# EAGLE design RevA (EAGLE 9.1.3)
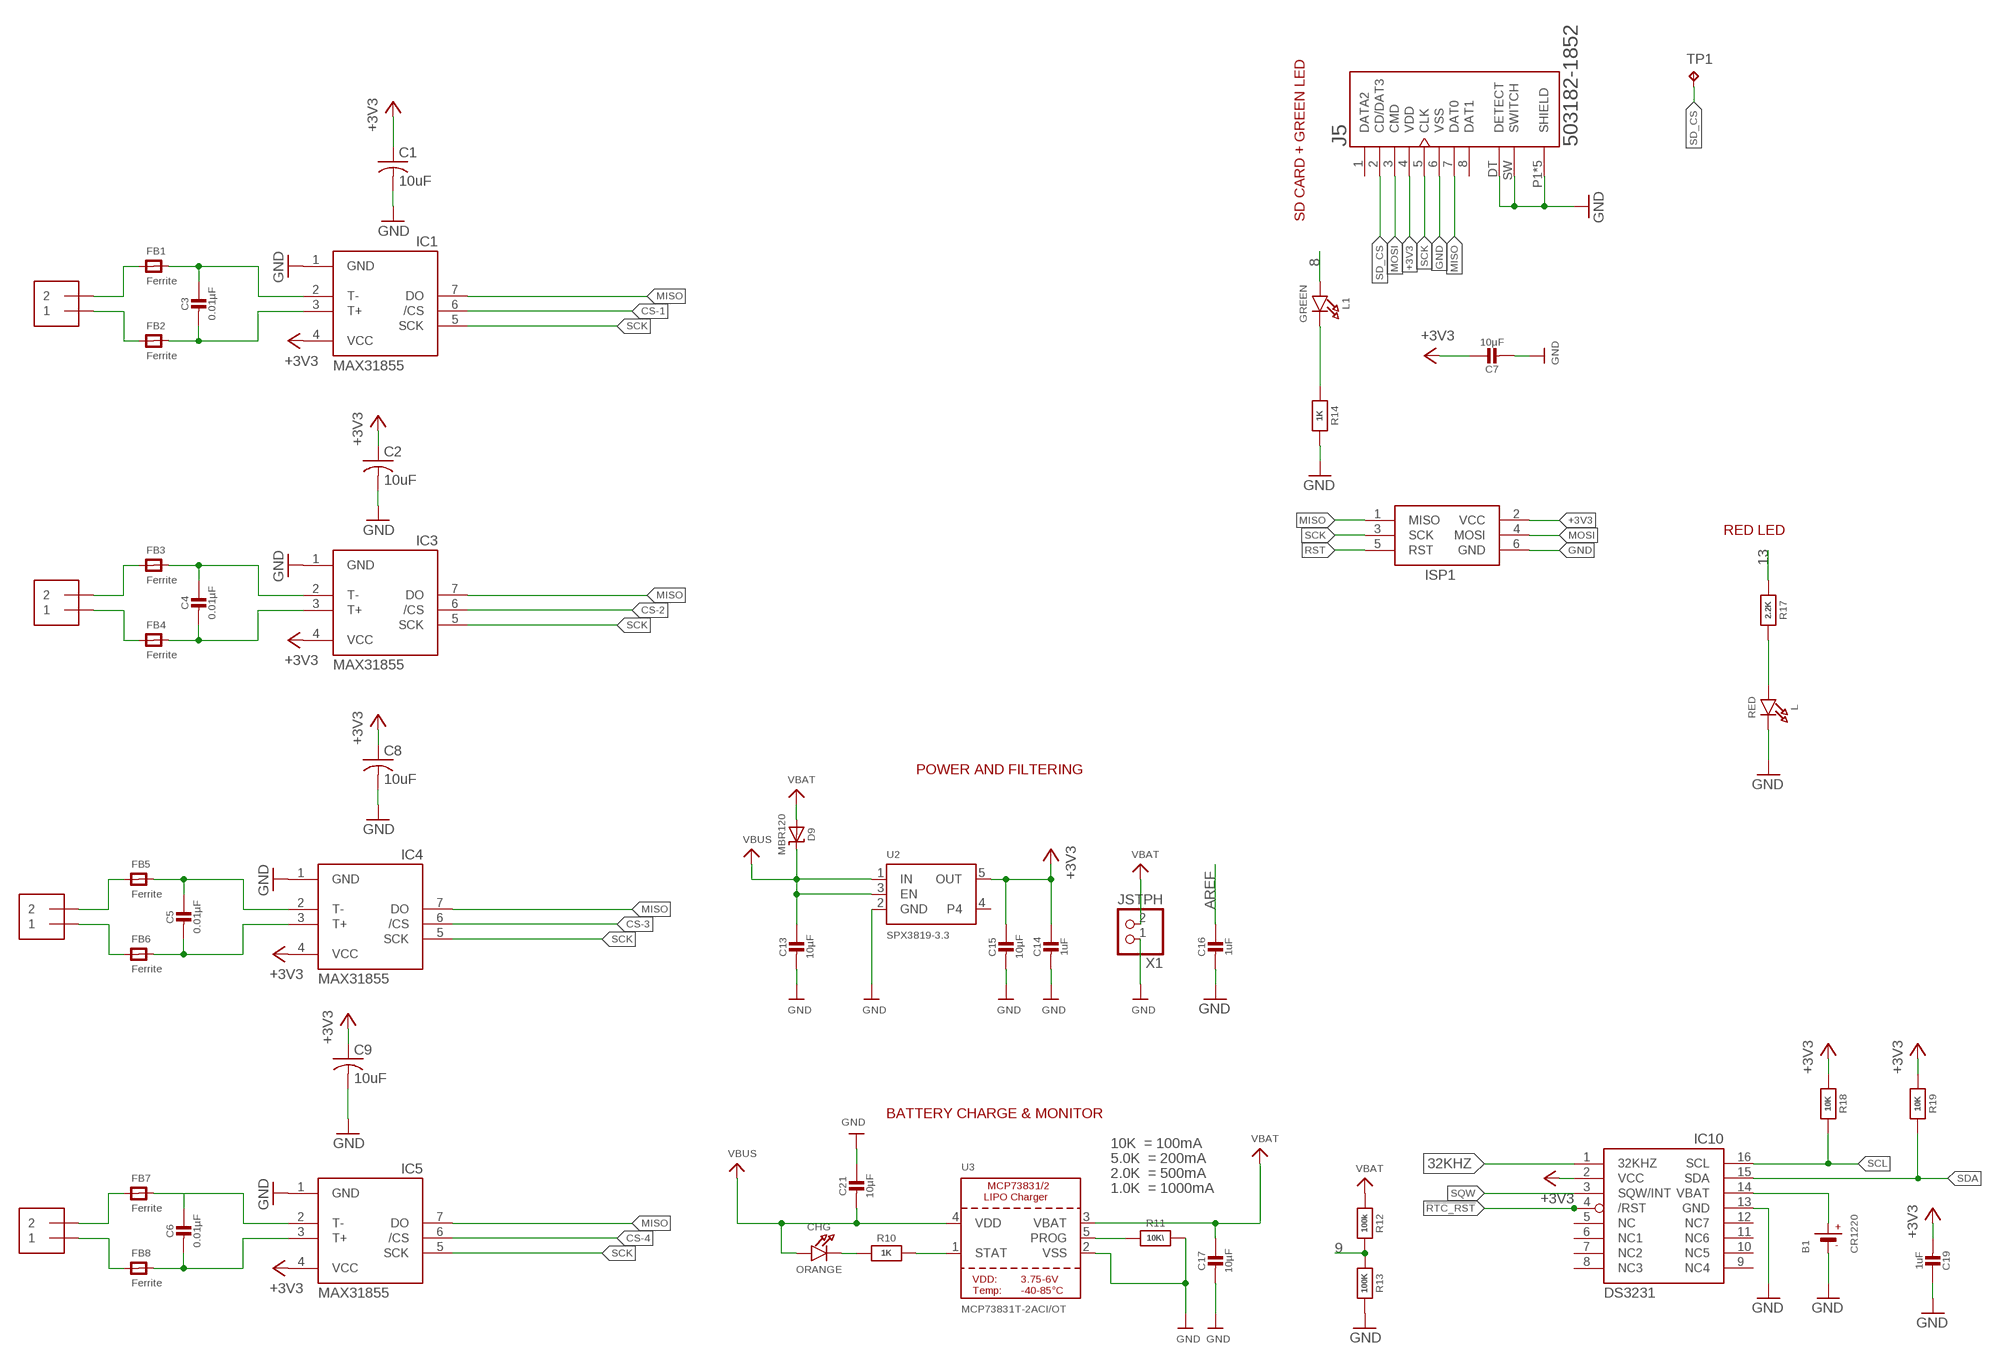
[diagram p0: schematic, sheet 1, part 1 of 2]
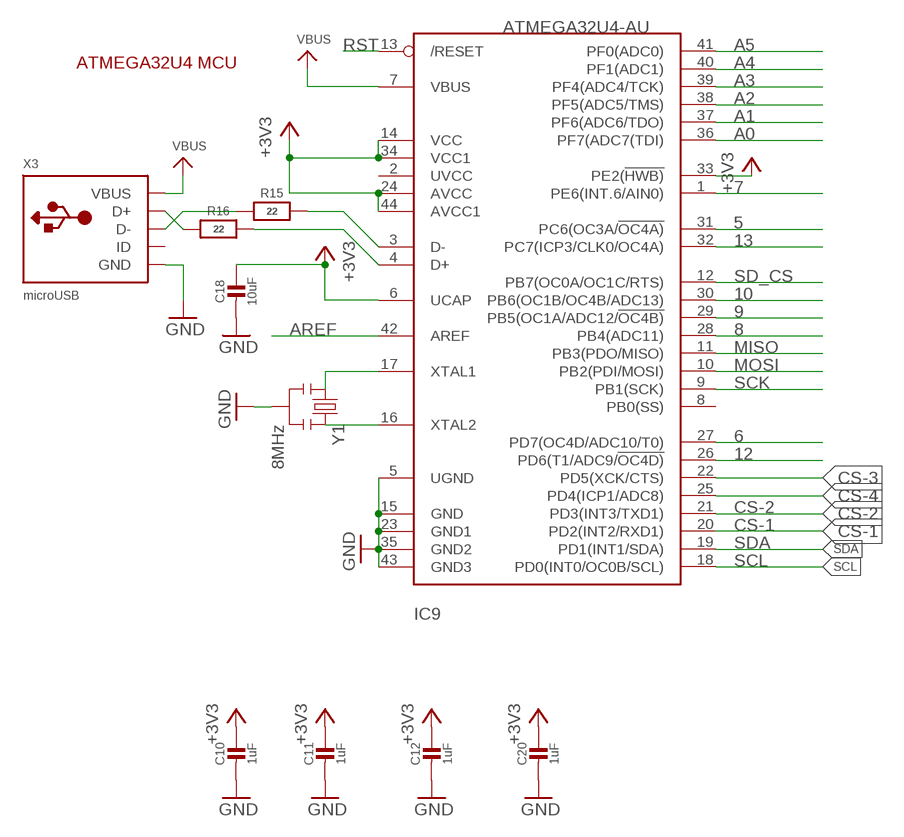
[diagram p1: schematic, sheet 1, part 2 of 2]

## Parts
B1  CR1220  BATTERYCR1220_SMT  [CR1220]
C1  10uF  C-USC0805K  [C0805K]
C2  10uF  C-USC0805K  [C0805K]
C3  0.01µF  CAP_CERAMIC_0805  [_0805]
C4  0.01µF  CAP_CERAMIC_0805  [_0805]
C5  0.01µF  CAP_CERAMIC_0805  [_0805]
C6  0.01µF  CAP_CERAMIC_0805  [_0805]
C7  10µF  CAP_CERAMIC0805-NOOUTLINE  [0805-NO]
C8  10uF  C-USC0805K  [C0805K]
C9  10uF  C-USC0805K  [C0805K]
C10  1uF  CAP_CERAMIC0603_NO  [0603-NO]
C11  1uF  CAP_CERAMIC0603_NO  [0603-NO]
C12  1uF  CAP_CERAMIC0603_NO  [0603-NO]
C13  10µF  CAP_CERAMIC0805-NOOUTLINE  [0805-NO]
C14  1uF  CAP_CERAMIC0603_NO  [0603-NO]
C15  10µF  CAP_CERAMIC0805-NOOUTLINE  [0805-NO]
C16  1uF  CAP_CERAMIC0603_NO  [0603-NO]
C17  10µF  CAP_CERAMIC0805-NOOUTLINE  [0805-NO]
C18  10uF  CAP_CERAMIC0805-NOOUTLINE  [0805-NO]
C19  1uF  CAP_CERAMIC0805-NOOUTLINE  [0805-NO]
C20  1uF  CAP_CERAMIC0603_NO  [0603-NO]
C21  10µF  CAP_CERAMIC0805-NOOUTLINE  [0805-NO]
CHG  ORANGE  LED0805_NOOUTLINE  [CHIPLED_0805_NOOUTLINE]
D9  MBR120  DIODE-SCHOTTKYSOD-123  [SOD-123]
FB1  Ferrite  FERRITE_0805  [_0805]
FB2  Ferrite  FERRITE_0805  [_0805]
FB3  Ferrite  FERRITE_0805  [_0805]
FB4  Ferrite  FERRITE_0805  [_0805]
FB5  Ferrite  FERRITE_0805  [_0805]
FB6  Ferrite  FERRITE_0805  [_0805]
FB7  Ferrite  FERRITE_0805  [_0805]
FB8  Ferrite  FERRITE_0805  [_0805]
IC1  MAX31855  MAX6675  [SO08]
IC3  MAX31855  MAX6675  [SO08]
IC4  MAX31855  MAX6675  [SO08]
IC5  MAX31855  MAX6675  [SO08]
IC9  ATMEGA32U4-AU  [TQFP44]
IC10  DS3231/SO  [SO16W]
ISP1  AVRISP-BOX  [AVRISP-BOX]
J1  1X2-3.5MM  [1X2-3.5MM]
J2  1X2-3.5MM  [1X2-3.5MM]
J3  1X2-3.5MM  [1X2-3.5MM]
J4  1X2-3.5MM  [1X2-3.5MM]
J5  503182-1852  [MOLEX_503182-1852]
L  RED  LED0805_NOOUTLINE  [CHIPLED_0805_NOOUTLINE]
L1  GREEN  LED0805_NOOUTLINE  [CHIPLED_0805_NOOUTLINE]
R10  1K  RESISTOR_0603_NOOUT  [0603-NO]
R11  10K\  RESISTOR_0603_NOOUT  [0603-NO]
R12  100k  RESISTOR_0603MP  [_0603MP]
R13  100K  RESISTOR_0603MP  [_0603MP]
R14  1K  RESISTOR_0603_NOOUT  [0603-NO]
R15  22  RESISTOR_0603_NOOUT  [0603-NO]
R16  22  RESISTOR_0603_NOOUT  [0603-NO]
R17  2.2K  RESISTOR_0603_NOOUT  [0603-NO]
R18  10K  RESISTOR0805_NOOUTLINE  [0805-NO]
R19  10K  RESISTOR0805_NOOUTLINE  [0805-NO]
TP1  TPPAD1-13  [P1-13]
U2  SPX3819-3.3  VREG_SOT23-5  [SOT23-5]
U3  MCP73831T-2ACI/OT  MCP73831/2  [SOT23-5]
X1  JSTPH  CON_JST_PH_2PIN  [JSTPH2]
X3  microUSB  USB_MICRO_20329_V2  [4UCONN_20329_V2]
Y1  8MHz  RESONATORSMD  [RESONATOR-SMD]

## Nets
5: IC9.31(PC6(OC3A/!OC4A))
6: IC9.27(PD7(OC4D/ADC10/T0))
7: IC9.1(PE6(INT.6/AIN0))
8: IC9.28(PB4(ADC11)) L1.A
9: IC9.29(PB5(OC1A/ADC12/!OC4B)) R12.2 R13.1
10: IC9.30(PB6(OC1B/OC4B/ADC13))
12: IC9.26(PD6(T1/ADC9/!OC4D))
13: IC9.32(PC7(ICP3/CLK0/OC4A)) R17.1
32KHZ: IC10.1(32KHZ)
!RTC_RST: IC10.4(/RST)
+3V3: C1.1 C2.1 C7.1 C8.1 C9.1 C10.1 C11.1 C12.1 C14.1 C15.1 C18.1 C19.2 C20.1 IC1.4(VCC) IC3.4(VCC) IC4.4(VCC) IC5.4(VCC) IC9.6(UCAP) IC9.14(VCC) IC9.24(AVCC) IC9.33(PE2(!HWB)) IC9.34(VCC1) IC9.44(AVCC1) IC10.2(VCC) ISP1.2(VCC) J5.4(VDD) R18.1 R19.1 U2.5(OUT)
A0: IC9.36(PF7(ADC7(TDI))
A1: IC9.37(PF6(ADC6/TDO))
A2: IC9.38(PF5(ADC5/TMS))
A3: IC9.39(PF4(ADC4/TCK))
A4: IC9.40(PF1(ADC1))
A5: IC9.41(PF0(ADC0))
AREF: C16.1 IC9.42(AREF)
CS-1: IC1.6(/CS) IC9.20(PD2(INT2/RXD1))
CS-2: IC3.6(/CS) IC9.21(PD3(INT3/TXD1))
CS-3: IC4.6(/CS) IC9.22(PD5(XCK/CTS))
CS-4: IC5.6(/CS) IC9.25(PD4(ICP1/ADC8))
D+: IC9.4(D+) R16.2
D-: IC9.3(D-) R15.2
GND: B1.- C1.2 C2.2 C7.2 C8.2 C9.2 C10.2 C11.2 C12.2 C13.2 C14.2 C15.2 C16.2 C17.2 C18.2 C19.1 C20.2 C21.1 IC1.1(GND) IC3.1(GND) IC4.1(GND) IC5.1(GND) IC9.5(UGND) IC9.15(GND) IC9.23(GND1) IC9.35(GND2) IC9.43(GND3) IC10.13(GND) ISP1.6(GND) J5.6(VSS) J5.DT(DETECT) J5.P1(SHIELD) J5.P2(SHIELD) J5.P3(SHIELD) J5.P4(SHIELD) J5.P5(SHIELD) J5.SW(SWITCH) L.C R11.2 R13.2 R14.2 U2.2(GND) U3.2(VSS) X1.1 X3.BASE@1(GND) X3.BASE@2(GND) X3.GND X3.SPRT@1(GND) X3.SPRT@2(GND) X3.SPRT@3(GND) X3.SPRT@4(GND) Y1.2
MISO: IC1.7(DO) IC3.7(DO) IC4.7(DO) IC5.7(DO) IC9.11(PB3(PDO/MISO)) ISP1.1(MISO) J5.7(DAT0)
MOSI: IC9.10(PB2(PDI/MOSI)) ISP1.4(MOSI) J5.3(CMD)
N$1: FB1.1 J1.2
N$2: FB3.1 J2.2
N$3: C4.1 FB3.2 IC3.2(T-)
N$4: C3.1 FB1.2 IC1.2(T-)
N$5: FB2.1 J1.1
N$6: C3.2 FB2.2 IC1.3(T+)
N$7: FB4.1 J2.1
N$8: C4.2 FB4.2 IC3.3(T+)
N$9: FB5.1 J3.2
N$10: C5.1 FB5.2 IC4.2(T-)
N$11: FB6.1 J3.1
N$12: C5.2 FB6.2 IC4.3(T+)
N$13: FB7.1 J4.2
N$14: C6.1 FB7.2 IC5.2(T-)
N$15: FB8.1 J4.1
N$16: C6.2 FB8.2 IC5.3(T+)
N$25: CHG.C R10.1
N$26: R10.2 U3.1(STAT)
N$27: R11.1 U3.5(PROG)
N$28: L1.C R14.1
N$29: IC9.16(XTAL2) Y1.3
N$30: IC9.17(XTAL1) Y1.1
N$31: R16.1 X3.D+
N$32: R15.1 X3.D-
N$33: L.A R17.2
RST: IC9.13(/RESET) ISP1.5(RST)
SCK: IC1.5(SCK) IC3.5(SCK) IC4.5(SCK) IC5.5(SCK) IC9.9(PB1(SCK)) ISP1.3(SCK) J5.5(CLK)
SCL: IC9.18(PD0(INT0/OC0B/SCL)) IC10.16(SCL) R18.2
SD_CS: IC9.12(PB7(OC0A/OC1C/RTS)) J5.2(CD/DAT3) TP1.TP
SDA: IC9.19(PD1(INT1/SDA)) IC10.15(SDA) R19.2
SQW: IC10.3(SQW/INT)
VBAT: C17.1 D9.A R12.1 U3.3(VBAT) X1.2
VBUS: C13.1 C21.2 CHG.A D9.C IC9.7(VBUS) U2.1(IN) U2.3(EN) U3.4(VDD) X3.VBUS
VCR: B1.+$1(+) IC10.14(VBAT)
Unconnected: IC9.2(UVCC) IC9.8(PB0(SS)) IC10.5(NC) IC10.6(NC1) IC10.7(NC2) IC10.8(NC3) IC10.9(NC4) IC10.10(NC5) IC10.11(NC6) IC10.12(NC7) J5.1(DATA2) J5.8(DAT1) U2.4 X3.ID

## Notes on the sheet
- ATMEGA32U4 MCU
- SD CARD + GREEN LED
- RED LED
- POWER AND FILTERING
- BATTERY CHARGE & MONITOR
- 10K  = 100mA
- 5.0K  = 200mA
- 2.0K  = 500mA
- 1.0K  = 1000mA

## Library data of the parts
B1 = microbuilder:BATTERY: CR1220 SMT - Digikey: 3001K-ND CD2032 BAT-HLD-001 - Digikey: BAT-HLD-001-ND
C1 C2 C8 C9 = adafruit:C-US: CAPACITOR, American symbol
C3-C7 C10-C21 = microbuilder:CAP_CERAMIC: Ceramic Capacitors For new designs, use the packages preceded by an '_' character since they are more reliable: The following footprints should be used on most boards: _0402 - Standard footprint for regular board layouts _0603 - Standard footprint for regular board layouts _0805 - Standard footprint for regular board layouts _1206 - Standard footprint for regular board layouts For extremely tight-pitch boards where space is at a premium, the following 'micro-pitch' footprints can be used (smaller pads, no silkscreen outline, etc.): _0402MP - Micro-pitch footprint for very dense/compact boards _0603MP - Micro-pitch footprint for very dense/compact boards _0805MP - Micro-pitch footprint for very dense/compact boards _1206MP - Micro-pitch footprint for very dense/compact boards
CHG L L1 = microbuilder:LED: LED 0603 - 0603 Surface Mount Package 2mA: Green LED - Low Power (3.9mcd, 2ma, 1.7Vf) - Digikey: 475-2709-2-ND Orange LED - Low Power (9.8mcd, 2ma, 1.8Vf) - Digikey: 475-1194-2-ND Red LED - Low Power (5mcd, 2ma, 1.8Vf) - Digikey: 475-1195-2-ND Yellow LED - Low Power (7mcd, 2ma, 1.8Vf) - Digikey: 475-1196-2-ND 5mA: Blue LED - Low Power (17mcd, 5ma, 2.9Vf) - Digikey: LNJ937W8CRACT-ND 0805 - 0805 Surface Mount Package 2mA: Red LED (8.8mcd, 2mA, 1.8Vf, Clear) - Low Power [Digikey: 475-2510-1-ND] Green LED (5mcd, 2mA, 1.8Vf, Clear) - Low Power [Digikey: 475-2730-1-ND] Yellow LED (11.3mcd, 2mA, 1.8Vf, Clear) - Low Power [Digikey: 475-2555-1-ND] 20mA: Red LED (104mcd, 20mA, Diffused) - LS R976 [Digikey: 475-1278-6-ND] Red LED (12mcd, 20mA, 2.0Vf, Clear) - APT2012EC [Digikey: 754-1128-1-ND] Green LED (15mcd, 20mA, 2.2Vf, Clear) - APT2012GC [Digikey: 754-1131-1-ND] Orange LED (160mcd, 20mA, 2.1Vf, Clear) - APT2012SECK [Digikey: 754-1130-1-ND] 1206 - 1206 Surface Mount Package Green LED (26mcd, 20mA, Diffused) - LG N971 [Digikey: 475-1407-6-ND] Red LED (15mcd, 20mA, Diffused) - LH N974 [Digikey: 475-1416-6-ND] Cree - Cree High-Power Surface Mount LEDs XPEBWT-L1-0000-00D50 - White 111lm 350mA 2.9Vf 6200K 110° XTEAWT-00-0000-00000LEE3 - White 114lm 350mA 2.85Vf 5000K 115° Everlight - Everlight 45-21 Series Surface Mount LEDs 45-21/QK2C-B2832AC2CB2/2T - Warm White 2000mcd 20mA 3.25Vf 3050K 120° 45-21/LK2C-B38452C4CB2/2T - Nuetral White 2000mcd 20mA 3.25Vf 4150K 120° 45-21/LK2C-B50634C6CB2/2T - Cold White 2200mcd 20mA 3.25Vf 5650K 120° PLCC2 Reverse Mount LS T77K-J1L2-1-0-2-R18-Z - Red 11.25mcd 2mA 1.8Vf 630nm 120° LO T77K-L1M2-24-Z - Orange 19.6mcd 2mA 1.8Vf 606nm 120° LY T77K-K2M1-26-Z - Yellow 15.7mcd 2mA 1.8Vf 587nm 120°
D9 = microbuilder:DIODE-SCHOTTKY
FB1-FB8 = microbuilder:FERRITE: Ferrite Bead 0603 MMZ1608B121C - 120 Ohm @ 100MHz, 600mA, 0.15 Ohm DC Resistance - Digikey: 445-2164-1-ND BK1608HW121-T - 120 Ohm, 600mA Ferrite Chip - Digikey: 587-1876-2-ND 0805 HZ0805B272R-10 - 2.7K Ohm @ 100MHz, 200mA, 0.8 Ohm DC Resistance - Digikey: 240-2504-1-ND (see also Murata BLM21BD272SN1L) MMZ2012Y152B - 1.5K Ohm @ 100MHz, 500mA, 0.4 Ohm DC Resistance - Digikey: 445-1560-1-ND - Mainly for high frequency (80-400MHz) MMZ2012R102A - 1K Ohm @ 100MHz, 500mA, 0.3 Ohm DC Resistance - Digikey: 445-1555-2-ND - More general purpose (10-200MHz)
IC1 IC3-IC5 = adafruit:MAX6675
IC9 = microbuilder:ATMEGA32U4: http://www.ladyada.net/library/eagle
IC10 = adafruit:DS3231
ISP1 = adafruit:AVRISP: AVR ISP HEADER Standard 6 pin header for AVR programming
J1-J4 = adafruit:1X2: 3.5mm Terminal block http://www.ladyada.net/library/pcb/eaglelibrary.html
J5 = 503182-1852:503182-1852: Conn Micro SD Card M 8 POS 1.09mm Solder RA SMD Embossed T/R 0.5A/Contact; DESCRIPTION: 1.10mm Pitch microSD Memory Card Connector, Normal Mount Surface Mount, Push-Push Type, 1.45mm Height, Anti-card fly-out; DIGI-KEY_PART_NUMBER: WM12834CT-ND; DIGI-KEY_PURCHASE_URL: https://www.digikey.com/product-detail/en/molex-llc/5031821852/WM12834CT-ND/5823232?utm_source=snapeda&utm_medium=aggregator&utm_campaign=symbol; MF: Molex; MP: 5031821852; PACKAGE: None
R10-R19 = microbuilder:RESISTOR: Resistors For new designs, use the packages preceded by an '_' character since they are more reliable: The following footprints should be used on most boards: _0402 - Standard footprint for regular board layouts _0603 - Standard footprint for regular board layouts _0805 - Standard footprint for regular board layouts _1206 - Standard footprint for regular board layouts For extremely tight-pitch boards where space is at a premium, the following 'micro-pitch' footprints can be used (smaller pads, no silkscreen outline, etc.): _0402MP - Micro-pitch footprint for very dense/compact boards _0603MP - Micro-pitch footprint for very dense/compact boards _0805MP - Micro-pitch footprint for very dense/compact boards _1206MP - Micro-pitch footprint for very dense/compact boards
TP1 = testpad:TP: Test pad
U2 = microbuilder:VREG_SOT23-5: SOT23-5 Fixed Voltage Regulators Part Current Out V Out V In V Dropout θJA (°C/W) TJ (°C) Digikey Part No. ADP121 150mA 3.3V 3.4-5.5V 0.09V @ 150mA -- -- ADP121-AUJZ33R7CT-ND ADP121 150mA 3.0V 3.1-5.5V 0.09V @ 150mA -- -- ADP121-AUJZ30R7CT-ND ADP122 300mA 3.3V 3.4-5.5V 0.085V @ 300mA -- -- ADP122AUJZ-3.3-R7CT-ND ADP1712 300mA 3.3V 3.5-5.5V 0.17V @ 300mA -- -- ADP1712AUJZ-3.3-R7TR-ND AP7311 (Low Cost) 150mA 3.3V 3.5-6V 0.15V @ 150mA -- -- AP7311-33WG-7DICT-ND LD39015M18R 150mA 1.8V 1.9V-5.5V 0.08V @ 100mA -- -- 497-6977-1-ND LP2985A-33DBVR 150mA 3.3V 3.3-16V 0.28V @ 150mA 206 150 296-18479-1-ND MCP1824T-3302E/OT 300mA 3.3V 3.5V-6V 0.2V @ 300mA -- -- MCP1824T-3302E/OTCT-ND MIC5205-2.5YM5 TR 150mA 2.5V 2.7-16V 0.165V @ 150mA -- -- 576-1257-2-ND MIC5205-3.0YM5 TR 150mA 3.0V 3.2V-16V 0.165V @ 150mA -- -- 576-1258-2-ND MIC5205-3.3YM5 TR 150mA 3.3V 3.5V-16V 0.165V @ 150mA -- -- 576-1259-2-ND TPS780330220 150mA 3.3V+2.2V 3.6-5.5V 250mV Max -- -- 296-23332-1-ND TDA3663/N1,135 100mA 3.3V 3.5-45V 0.18V @ 50mA -- -- 568-5343-1-ND Max operating temp can be calculated using θJA, TJ (max junction temperature), and power in watts. Set the "Maximum Ambient Temperature" until it reaches TJ ("Max Junction Temperature"), which is the absolute limit for safe use of the regulator: Heat Sink Temperature Calculator <http://www.daycounter.com/Calculators/Heat-Sink-Temperature-Calculator.phtml> For example, With 12V source into a 3.3V LP2985 and a 30mA load, we are dissipating (12V-3.3V) * 0.03A = 0.261W. With a θJA of 206 °C/W, a TJ of 150°C, and 261mW we can safely use the chip without a heat sink up to 75°C (=147.1°C Junction Temperature).
U3 = microbuilder:MCP73831/2: MCP73831/2 LIPO Charger VDD: 3.75 - 6V Temp -40 - 85°C Programmable Charge Rate: 15-500mA NOTE: STAT is a tri-state logic output on the MCP73831 and an open-drain output on the MCP73832. SOT23-5 with 4.2V output and tri-state logic on STAT = MCP73831T-2ACI/OT
X1 = microbuilder:CON_JST_PH_2PIN: JST 2-Pin Right-Angle Connector PH-Series - 4UConnector: 17311 SH-Series - 4UConnector: 07278
X3 = microbuilder:USB: USB Connectors USBMINIB - Surface Mount Female Mini-B USB Connector 4UConnector: 06564
Y1 = SparkFun:RESONATOR: Resonator Small SMD resonator. This is the itty bitty 10/20MHz resonators with built in caps. CSTCE10M0G55 and CSTCE20M0V53. Footprint has been reviewed closely but hasn't been tested yet.

## Board
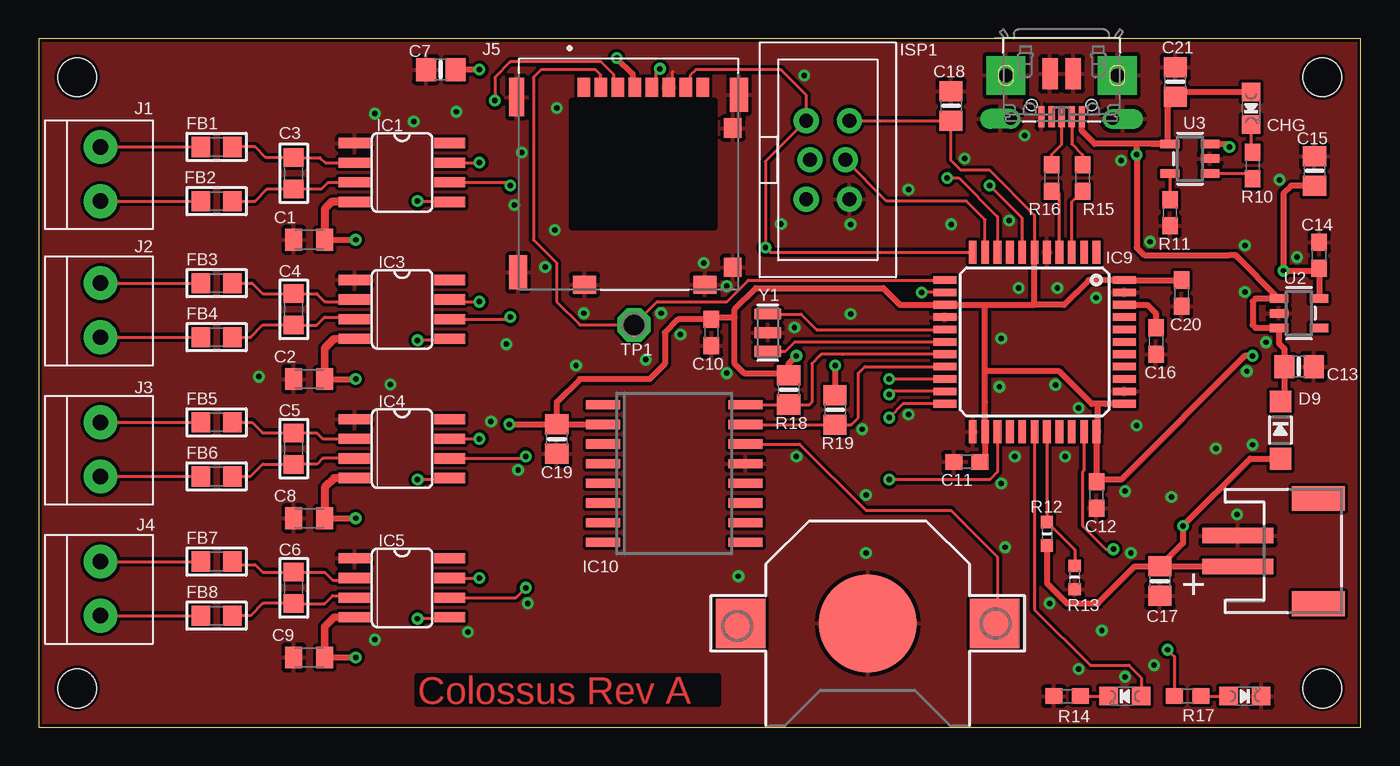
[diagram p2: board, top side]
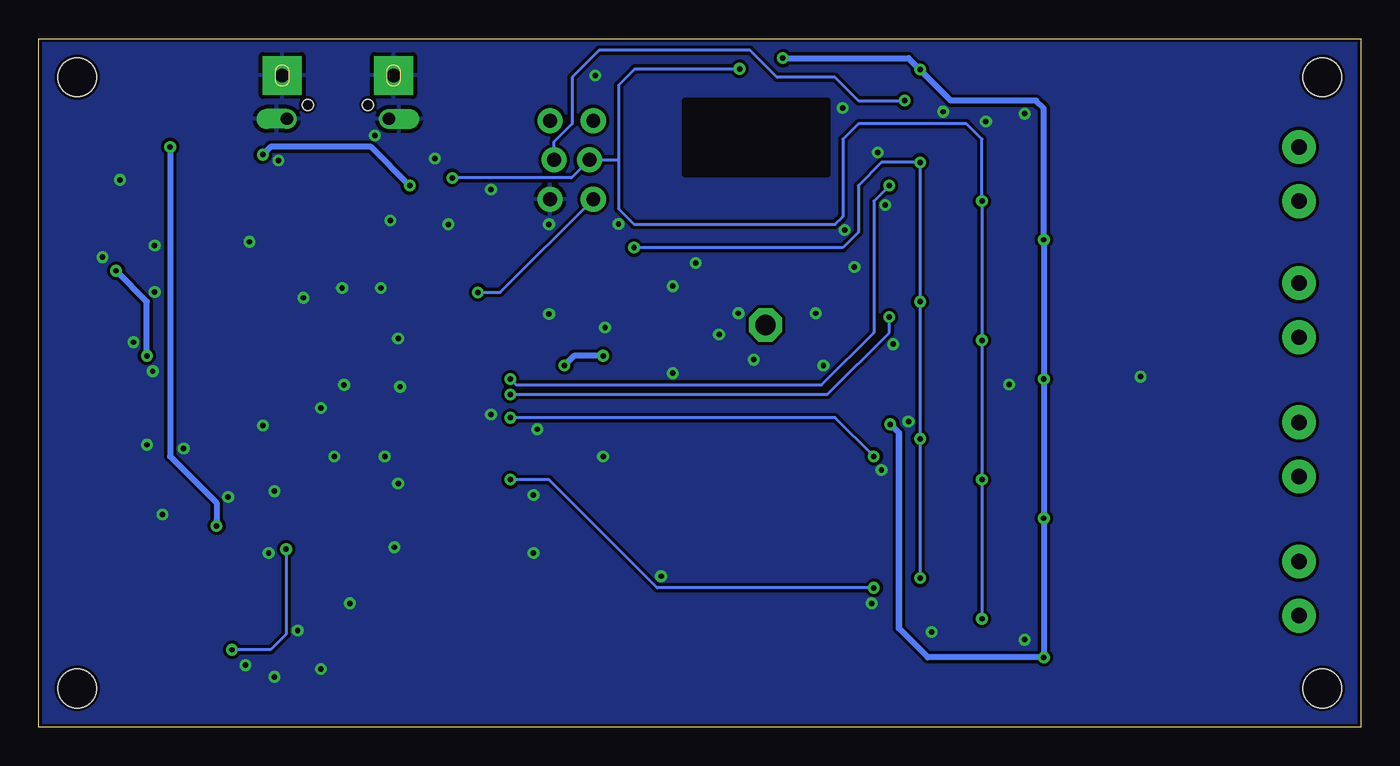
[diagram p3: board, bottom side, seen from below]

Size 85.5 x 44.5 mm. Coordinates in mm from the lower left corner, seen from the top.
Outline: 0,0 85.5,0 85.5,44.5 0,44.5 0,0
Copper layers (1*16): Top 0.035mm / dielectric 1.5mm / Bottom 0.035mm
Design rules "default *": minimum track width 8mil, minimum drill 0.35mm, track to track 8mil, track to pad 8mil, pad to pad 8mil, via to via 8mil, smd to smd 8mil, copper to edge 0.2mm, drill to drill 6mil, minimum pad ring 10mil, minimum via ring 8mil, stop-mask expansion 4mil, vias tented up to drill 25mil, thermal gap 10mil
Holes 2.5 mm at 2.5,2.5 83,42 83,2.5 2.5,42

### Footprints (pad centres in the part's own frame; a part is rotated, then mirrored left to right if it is on the bottom)
CR1220 = smd 3.2 x 3.2: +$1 -8.225,0; +$2 8.225,0 | smd 6.35 x 6.35: - 0,0
C0805K = smd 1.1 x 1.4: 1 -1,0; 2 1,0
_0805 = smd 1.2 x 1.3: 1 -1.016,0; 2 1.016,0
0805-NO = smd 1.3 x 1.5: 1 -0.95,0; 2 0.95,0
0603-NO = smd 1.1 x 1: 1 -0.85,0; 2 0.85,0
CHIPLED_0805_NOOUTLINE = smd 1.2 x 1.2: A 0,-1.05; C 0,1.05
SOD-123 = smd 1.4 x 1.4: A 1.85,0; C -1.85,0
SO08 = smd 0.66 x 2.032: 1 -1.905,-3.073; 2 -0.635,-3.073; 3 0.635,-3.073; 4 1.905,-3.073; 5 1.905,3.073; 6 0.635,3.073; 7 -0.635,3.073; 8 -1.905,3.073
TQFP44 = smd 1.5 x 0.5: 1 -5.8,4; 2 -5.8,3.2; 3 -5.8,2.4; 4 -5.8,1.6; 5 -5.8,0.8; 6 -5.8,0; 7 -5.8,-0.8; 8 -5.8,-1.6; 9 -5.8,-2.4; 10 -5.8,-3.2; 11 -5.8,-4; 23 5.8,-4; 24 5.8,-3.2; 25 5.8,-2.4; 26 5.8,-1.6; 27 5.8,-0.8; 28 5.8,0; 29 5.8,0.8; 30 5.8,1.6; 31 5.8,2.4; 32 5.8,3.2; 33 5.8,4 | smd 0.5 x 1.5: 12 -4,-5.8; 13 -3.2,-5.8; 14 -2.4,-5.8; 15 -1.6,-5.8; 16 -0.8,-5.8; 17 0,-5.8; 18 0.8,-5.8; 19 1.6,-5.8; 20 2.4,-5.8; 21 3.2,-5.8; 22 4,-5.8; 34 4,5.8; 35 3.2,5.8; 36 2.4,5.8; 37 1.6,5.8; 38 0.8,5.8; 39 0,5.8; 40 -0.8,5.8; 41 -1.6,5.8; 42 -2.4,5.8; 43 -3.2,5.8; 44 -4,5.8
SO16W = smd 0.6 x 2.2: 1 -4.445,-4.6; 2 -3.175,-4.6; 3 -1.905,-4.6; 4 -0.635,-4.6; 5 0.635,-4.6; 6 1.905,-4.6; 7 3.175,-4.6; 8 4.445,-4.6; 9 4.445,4.6; 10 3.175,4.6; 11 1.905,4.6; 12 0.635,4.6; 13 -0.635,4.6; 14 -1.905,4.6; 15 -3.175,4.6; 16 -4.445,4.6
AVRISP-BOX = drill 0.9 pad 1.626: 1 -1.397,2.54; 2 1.397,2.54; 3 -1.143,0; 4 1.143,0; 5 -1.397,-2.54; 6 1.397,-2.54
1X2-3.5MM = drill 1 pad 2.184: 1 1.8,0; 2 -1.7,0
MOLEX_503182-1852 = smd 0.8 x 1.24: 1 -2.9,6.355; 2 -1.8,6.355; 3 -0.7,6.355; 4 0.4,6.355; 5 1.5,6.355; 6 2.6,6.355; 7 3.7,6.355; 8 4.8,6.355 | smd 1.16 x 1.2: DT 6.74,-5.275 | smd 0.95 x 2.5: P1 -7.245,5.725 | smd 1.15 x 2.2: P2 7.145,5.875; P3 -7.145,-5.605 | smd 1.5 x 1.15: P4 -2.84,-6.4; P5 4.94,-6.4 | smd 1.16 x 1.25: SW 6.74,3.725
_0603MP = smd 0.8 x 0.8: 1 -0.762,0; 2 0.762,0
P1-13 = drill 1.321 pad 2.159 octagon: TP 0,0
SOT23-5 = smd 0.55 x 1.2: 1 -0.95,-1.3; 2 0,-1.3; 3 0.95,-1.3; 4 0.95,1.3; 5 -0.95,1.3
JSTPH2 = smd 1 x 4.6: 1 -1,-3.7; 2 1,-3.7 | smd 1.6 x 3.4: NC1 -3.4,1.5; NC2 3.4,1.5
4UCONN_20329_V2 = smd 1 x 2: BASE@1 -0.75,-2; BASE@2 0.75,-2 | smd 0.4 x 1.35: D+ 0,0.775; D- -0.65,0.775; GND 1.3,0.775; ID 0.65,0.775; VBUS -1.3,0.775 | drill 0.8 pad 1.2 offset: SPRT@1 -3.3,0.9; SPRT@2 3.3,0.9 | drill 0.9 pad 2.5 square: SPRT@3 -3.6,-1.9; SPRT@4 3.6,-1.9 | hole 0.7: -1.95,0; 1.95,0
RESONATOR-SMD = smd 0.7 x 1.7: 1 -1.2,0; 2 0,0; 3 1.2,0

### Placement (x,y rotation side)
B1  53.61,6.7 180 top
C1  17.5,31.5 180 top
C2  17.5,22.5 180 top
C3  16.5,35.8 270 top
C4  16.5,27 270 top
C5  16.5,18 270 top
C6  16.5,9 270 top
C7  26,42.5 180 top
C8  17.5,13.5 180 top
C9  17.5,4.5 180 top
C10  43.5,25.5 270 top
C11  60.02,17.15 180 top
C12  68.4,15 270 top
C13  81.5,23.3 0 top
C14  82.8,30.5 90 top
C15  82.5,35.95 90 top
C16  72.25,24.95 270 top
C17  72.5,9.44 270 top
C18  59,40.15 90 top
C19  33.5,18.62 90 top
C20  73.9,28.05 270 top
C21  73.5,41.7 270 top
CHG  78.4,40 180 top
D9  80.3,19.2 270 top
FB1  11.5,37.5 0 top
FB2  11.5,34 0 top
FB3  11.5,28.7 0 top
FB4  11.5,25.2 0 top
FB5  11.5,19.7 0 top
FB6  11.5,16.2 0 top
FB7  11.5,10.7 0 top
FB8  11.5,7.2 0 top
IC1  23.5,35.85 270 top
IC3  23.5,27 270 top
IC4  23.5,18 270 top
IC5  23.5,9 270 top
IC9  64.4,24.9 270 top
IC10  41.1,16.39 270 top
ISP1  51.03,36.66 0 top
J1  4,35.8 270 top
J2  4,27 270 top
J3  4,18 270 top
J4  4,9 270 top
J5  38.14,35 0 top
L  78,2 270 top
L1  70.25,2 90 top
R10  78.5,36.3 270 top
R11  73.15,33.25 270 top
R12  65.2,12.5 90 top
R13  67,9.67 270 top
R14  66.5,2 180 top
R15  67.5,35.5 270 top
R16  65.5,35.5 270 top
R17  74.3,2 0 top
R18  48.5,21.8 270 top
R19  51.5,20.5 270 top
TP1  38.5,26 0 top
U2  81.5,26.75 270 top
U3  74.45,36.75 90 top
X1  81.25,11.38 270 top
X3  66.15,40.22 180 top
Y1  47.15,25.5 90 top

### Tracks (layer width: path | path; a pad name or v marks a point on that pad's centre or on a via)
8
  Top 0.203: IC9.28 64.4,7.6 68,4 70.5,4 71.3,3.2 L1.A
9
  Top 0.203: IC9.29 R12.2 67,11.46 R13.1
13  (via drill 0.35)
  Top 0.203: v73,5 73.45,4.55 R17.1 | IC9.32 67.6,16.6 67.5,16.5 67.5,13 69,11.5 v69.5,11.5
  Bottom 0.203: v69.5,11.5 69.5,6 70.5,5 v73,5
+3V3  (via drill 0.35)
  Top 0.203: C14.1 | C14.1 82.8,29.5 | C19.2 | R18.1 48.62,22.88 | ISP1.2 C18.1 59,36.62 59.62,36 61.5,36 64.4,33.1 64.4,31 IC9.6 | 61.2,27.3 61,27.3 | IC9.33 68.5,19.1 | 61.2,17.48 C11.1 | C10.1 43.65,26.5 C10.1
  Top 0.4: C1.1 v20.5,31.5 | C2.1 v20.5,22.5 | C8.1 v20.5,13.5 | C9.1 v20.5,4.5 | U2.5 82.8,29.5 v80.5,29.5 80.5,34.5 81,35 C15.1 | v37.38,43.25 38.42,42.2 38.42,41.48 J5.4 | v28.5,42.5 C7.1 | C19.2 IC10.2 | IC9.33 68.4,16 | 68.4,16 C12.1 | 48.62,22.88 45.62,22.88 45,23.5 45,26.5 | v30.43,19.57 C19.2 33.5,21 35,22.5 39.5,22.5 40.5,23.5 40.5,25.5 41.35,26.35 C10.1 | R18.1 48.5,23.5 v49,24 | v51.5,23.38 R19.1 | C20.1 IC9.44 67.9,28.9 66.3,27.3 64.4,27.3 | 64.4,27.3 61,27.3 IC9.14 55.7,27.3 54.62,28.38 46.38,28.38 45,27 45,26.5 | 64.4,27.3 64.4,31 | 61.2,23 61.2,21 IC9.24 61.2,17.48 | 61.2,23 61.2,27.3 | IC9.34 69,20.9 | 69,20.9 68.5,20.9 68.5,19.1 | v78.5,24 78,24 70,16 68.4,16 | 69,20.9 68.1,20.9 66,23 61.2,23 | 43.65,26.5 45,26.5
  Top 0.5: IC3.4 19.09,25.09 | 18.5,24.5 C2.1 | IC5.4 19.09,7.09 18.5,6.5 C9.1
  Top 0.508: 19.09,25.09 18.5,24.5 | IC4.4 19.09,16.09 18.5,15.5 C8.1 | IC1.4 18.95,33.95 18.5,33.5 C1.1
  Bottom 0.4: v37.38,43.25 29.25,43.25 v28.5,42.5 26.5,40.5 21,40.5 20.5,40 v20.5,31.5 v20.5,22.5 v20.5,13.5 v20.5,4.5 28,4.5 29.88,6.38 | v78.5,24 78.5,27.5 v80.5,29.5 | v49,24 50.88,24 v51.5,23.38
  Bottom 0.406: v30.43,19.57 29.88,19.02 29.88,6.38
AREF
  Top 0.4: IC9.42 71.7,27.3 72.25,26.75 C16.1
CS-1  (via drill 0.35)
  Top 0.203: IC9.20 v55,22.5 | IC1.6 30.29,35.22 v30.5,35
  Bottom 0.203: v30.5,35 31.5,34 31.5,25.5 34.88,22.12 54.62,22.12 v55,22.5
CS-2  (via drill 0.35)
  Top 0.203: IC9.21 55.2,21.7 v55,21.5 | IC3.6 30.36,26.36 v30.5,26.5
  Bottom 0.203: v55,21.5 34.5,21.5 30.5,25.5 v30.5,26.5
CS-3  (via drill 0.35)
  Top 0.203: IC9.22 55.9,20.9 v55,20 | IC4.6 31.36,17.36 v31.5,17.5
  Bottom 0.203: v31.5,17.5 34,20 v55,20
CS-4  (via drill 0.35)
  Top 0.203: IC9.25 62,16.5 61.5,16 v55,16 | IC5.6 30.86,8.37 v31.5,9
  Bottom 0.203: v31.5,9 45.5,9 52.5,16 v55,16
D+
  Top 0.203: R16.2 65.85,34.65 66,34.5 IC9.4
D-
  Top 0.203: IC9.3 66.8,33 66.8,33.25 66.8,33.95 R15.2
GND  (via drill 0.35)
  Top 0.203: 41,41.75 41,42.38
  other vias: 43,30 44.5,22.88 52.5,32.5 59,32.5 52.5,26.7 71,19.5 22.75,22.15 14.25,22.65 24.25,39.15 21.75,39.65 27.75,6.15 21.75,5.65 56.25,34.75 65.75,22.12 67.25,20.62 62.12,22 68.38,27.75 62.25,25.12 65.88,28.38 63.38,28.38 66.38,17.5 63.12,17.5 77.5,13.75 65.38,8 41.5,25.38 48.88,25.82 53.5,11.25 33.5,40.02 56.25,20.2 62.25,15.75 70.25,15.25 31.25,37.15 27,39.77 48,32.52 62.75,32.75 59.88,36.75 71.88,31.38 80.25,35.38 34.75,23.38 31.62,8 72.12,4 81.38,30.38 78,28.12 78,31.12 62.5,11.62 53.5,15 49,17.5 53.25,19.25 44.5,28.5 78.12,23 76.12,18 70.25,3.25 68.75,6.25 30.25,24.75 29.25,19.75 31,16.62 78.5,18.25 63.75,38.25 70.62,11.25 33.38,32.12 32.75,29.75 35.25,26.75 40.25,26.75 39.25,23.75 30.75,33.75 67.25,3.75 49.5,42.12 79.38,24.88 73.25,14.88 70,36.62 45.25,9.75
  pour Top (isolate 0.203): 0,44.5 85.5,44.5 85.5,0 0,0 0,2
  pour Bottom (isolate 0.203): 0,44.5 0,0 1,0 85.5,0 85.5,44.5
MISO  (via drill 0.35)
  Top 0.203: J5.7 42.12,41.63 42.12,42.12 42.5,42.5 48,42.5 49.63,40.87 ISP1.1 47,36.57 v47,31 47.3,30.7 IC9.11 | IC1.7 28.48,36.48 v28.5,36.5 | IC3.7 26.71,27.5 v28.5,27.5 | IC4.7 28.36,18.64 v28.5,18.64 | IC5.7 28.36,9.63 v28.5,9.63
  Bottom 0.203: v28.5,9.63 v28.5,18.64 v28.5,27.5 v28.5,36.5 31,36.5 32.5,35 32.5,32 33.5,31 v47,31
MOSI  (via drill 0.35)
  Top 0.203: IC9.10 61.2,32.8 60,34 54.84,34 ISP1.4 | v29.5,40.5 29.5,42 30.5,43 36.38,43 37.2,42.18 37.2,41.6 J5.3
  Bottom 0.203: ISP1.4 52.17,37.83 51,39 51,42 49.25,43.75 39.5,43.75 37.75,42 34,42 32.5,40.5 v29.5,40.5
N$1
  Top 0.203: J1.2 FB1.1
N$2
  Top 0.203: J2.2 FB3.1
N$3
  Top 0.203: FB3.2 13.8,28.7 14.5,28 16.48,28 C4.1 17.98,28.02 18.5,27.5 20.34,27.5 IC3.2
N$4
  Top 0.203: FB1.2 14,37.5 14.68,36.82 C3.1 18.18,36.82 18.52,36.48 IC1.2
N$5
  Top 0.203: J1.1 FB2.1
N$6
  Top 0.203: FB2.2 14,34 14.78,34.78 C3.2 18.28,34.78 18.71,35.22 IC1.3
N$7
  Top 0.203: J2.1 FB4.1
N$8
  Top 0.203: FB4.2 13.7,25.2 14.5,26 16.48,26 C4.2 17.98,25.98 18.5,26.5 20.24,26.5 IC3.3
N$9
  Top 0.203: J3.2 FB5.1
N$10
  Top 0.203: FB5.2 13.8,19.7 14.48,19.02 C5.1 17.98,19.02 18.36,18.64 IC4.2
N$11
  Top 0.203: J3.1 FB6.1
N$12
  Top 0.203: FB6.2 13.7,16.2 14.5,17 16.48,17 | 16.48,17 C5.2 | IC4.3 18.36,17.36 18,17 16.48,17
N$13
  Top 0.203: J4.2 FB7.1
N$14
  Top 0.203: FB7.2 12.72,10.5 14,10.5 14.5,10 16.48,10 C6.1 16.52,10 18.5,10 19,9.5 20.29,9.5 IC5.2
N$15
  Top 0.203: J4.1 FB8.1
N$16
  Top 0.203: FB8.2 13.7,7.2 14.5,8 16.48,8 C6.2 18.48,7.98 19,8.5 20.29,8.5 IC5.3
N$25
  Top 0.203: CHG.C 78.4,37.25 R10.1
N$26
  Top 0.203: U3.1 78.15,35.8 R10.2
N$27
  Top 0.203: U3.5 R11.1 | R11.1
N$28
  Top 0.203: R14.1 L1.C
N$29
  Top 0.203: Y1.3 49.3,26.7 50.3,25.7 IC9.16
N$30
  Top 0.203: IC9.17 48.9,24.9 48.3,24.3 Y1.1
N$31
  Top 0.203: X3.D+ 66.15,37.65 65.5,37 R16.1
N$32
  Top 0.203: X3.D- 66.8,37.7 67.5,37 R15.1
N$33
  Top 0.203: R17.2 L.A
RST  (via drill 0.35)
  Top 0.203: IC9.13 v57.1,28.1
  Bottom 0.203: v57.1,28.1 55.66,28.1 ISP1.5
SCK  (via drill 0.35)
  Top 0.203: IC9.9 62,33 59.5,35.5 v58.75,35.5 | IC4.5 26.48,16 v24.5,16 | IC3.5 26.48,25 v24.5,25 | IC1.5 24.55,33.95 v24.5,34 | J5.5 39.65,41.65 39.92,41.92 39.92,42.3 v40.17,42.55 | IC5.5 26.48,7 v24.5,7
  Bottom 0.203: v24.5,7 v24.5,16 v24.5,25 v24.5,34 24.5,38 25.5,39 32.5,39 33.5,38 33.5,33 34,32.5 47,32.5 48,33.5 48,36.5 | v58.75,35.5 51.05,35.5 ISP1.3 48,36.66 48,36.5 | v40.17,42.55 46.95,42.55 48,41.5 48,36.5
SCL
  Top 0.203: IC10.16 48.48,20.84 R18.2 49.85,20.85 50,21 50,23.5 50.5,24 50.6,24.1 52,24.1 IC9.18
SD_CS
  Top 0.203: J5.2 36.34,42.16 36,42.5 32.5,42.5 32,42 32,31.5 33.5,30 33.5,27.5 35,26 TP1.TP 40,27.5 44.5,27.5 45.9,28.9 IC9.12
SDA
  Top 0.203: IC10.15 45.77,19.5 51.45,19.5 R19.2 52.55,19.55 53,20 53,22.88 53.42,23.3 IC9.19
VBAT  (via drill 0.35)
  Top 0.203: X1.2
  Top 0.4: C17.1 X1.2 | R12.1 65.2,9.3 66.5,8 68.5,8 70.89,10.39 C17.1 | U3.3 76.8,37.7 v77,37.5 | C17.1 74,11.89 v74,13 78.35,17.35 D9.A
  Bottom 0.4: v77,37.5 77,17.5 74,14.5 v74,13
VBUS  (via drill 0.35)
  Top 0.203: U3.4 73,37.7 | IC9.7 63.6,32.9 v61.5,35
  Top 0.4: 73,37.7 72,37.7 | 72,37.7 71,37.7 | 71,37.7 68.3,37.7 67.45,38.55 X3.VBUS | 72,37.7 73,37.7 | 73,37.7 73,40.05 C21.2 73.8,41.05 CHG.A | 71,37.7 v71,37 71,31 71.5,30.5 77,30.5 77.4,30.5 U2.1 78.7,27.7 78.5,27.5 78.5,26 78.7,25.8 U2.3 80.2,24.8 80.55,24.45 C13.1 80.55,21.3 D9.C
  Bottom 0.4: v61.5,35 64,37.5 70.5,37.5 v71,37
VCR
  Top 0.203: IC10.14 49.2,18.3 53.5,14 59,14 62,11 62,6.87 B1.+$1

### Text on the board
Top: Colossus Rev A
tNames: +
tStop: Colossus Rev A